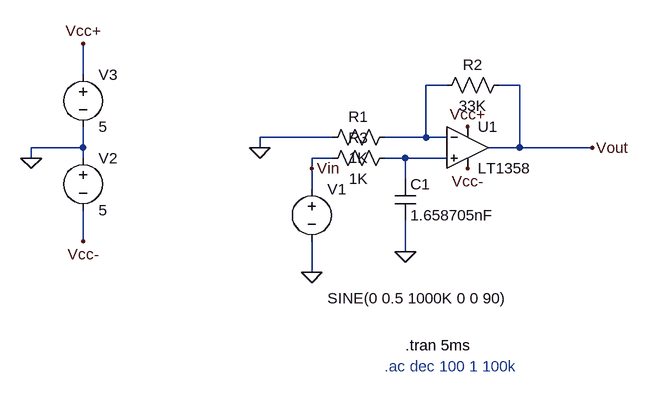
[diagram p0: schematic IQAmpOld.asc]
IQAmpOld.asc, the LTspice schematic file:
Version 4
SHEET 1 1244 912
WIRE 208 -48 208 -96
WIRE 768 -32 736 -32
WIRE 880 -32 848 -32
WIRE 592 48 480 48
WIRE 736 48 736 -32
WIRE 736 48 672 48
WIRE 768 48 736 48
WIRE 208 64 208 32
WIRE 208 64 128 64
WIRE 480 64 480 48
WIRE 880 64 880 -32
WIRE 880 64 832 64
WIRE 992 64 880 64
WIRE 128 80 128 64
WIRE 208 80 208 64
WIRE 592 80 560 80
WIRE 704 80 672 80
WIRE 768 80 704 80
WIRE 560 96 560 80
WIRE 704 112 704 80
WIRE 560 128 560 96
WIRE 208 208 208 160
WIRE 704 224 704 176
WIRE 560 256 560 208
FLAG 560 256 0
FLAG 480 64 0
FLAG 992 64 Vout
FLAG 128 80 0
FLAG 208 -96 Vcc+
FLAG 800 32 Vcc+
FLAG 800 96 Vcc-
FLAG 208 208 Vcc-
FLAG 560 96 Vin
FLAG 704 224 0
SYMBOL Voltage 560 112 R0
WINDOW 3 24 184 Left 2
SYMATTR Value SINE(0 0.5 1000K 0 0 90)
SYMATTR Value2 AC 0.1 0
SYMATTR InstName V1
SYMBOL Res 688 32 R90
WINDOW 0 0 56 VBottom 2
WINDOW 3 32 56 VTop 2
SYMATTR InstName R1
SYMATTR Value 1K
SYMBOL Res 864 -48 R90
WINDOW 0 0 56 VBottom 2
WINDOW 3 32 56 VTop 2
SYMATTR InstName R2
SYMATTR Value 33K
SYMBOL Voltage 208 64 R0
SYMATTR InstName V2
SYMATTR Value 5
SYMBOL Voltage 208 -64 R0
SYMATTR InstName V3
SYMATTR Value 5
SYMBOL Cap 688 112 R0
SYMATTR InstName C1
SYMATTR Value 1.658705nF
SYMBOL Res 688 64 R90
WINDOW 0 0 56 VBottom 2
WINDOW 3 32 56 VTop 2
SYMATTR InstName R3
SYMATTR Value 1K
SYMBOL OpAmps/LT1358 800 0 R0
SYMATTR InstName U1
TEXT 704 368 Left 2 !.tran 5ms
TEXT 672 400 Left 2 ;.ac dec 100 1 100k

The netlist it stands for:
* IQAmpOld.asc
V1 Vin 0 SINE(0 0.5 1000K 0 0 90) AC 0.1 0
R1 N001 0 1K
R2 Vout N001 33K
V2 0 Vcc- 5
V3 Vcc+ 0 5
C1 N002 0 1.658705nF
R3 N002 Vin 1K
XU1 N002 N001 Vcc+ Vcc- Vout LT1357  ; LT1358, pins In+ In- V+ V- OUT
.tran 5ms
* .ac dec 100 1 100k
.lib LTC.lib
.backanno
.end